# EAGLE design cable-concentrator (EAGLE 7.3.0)
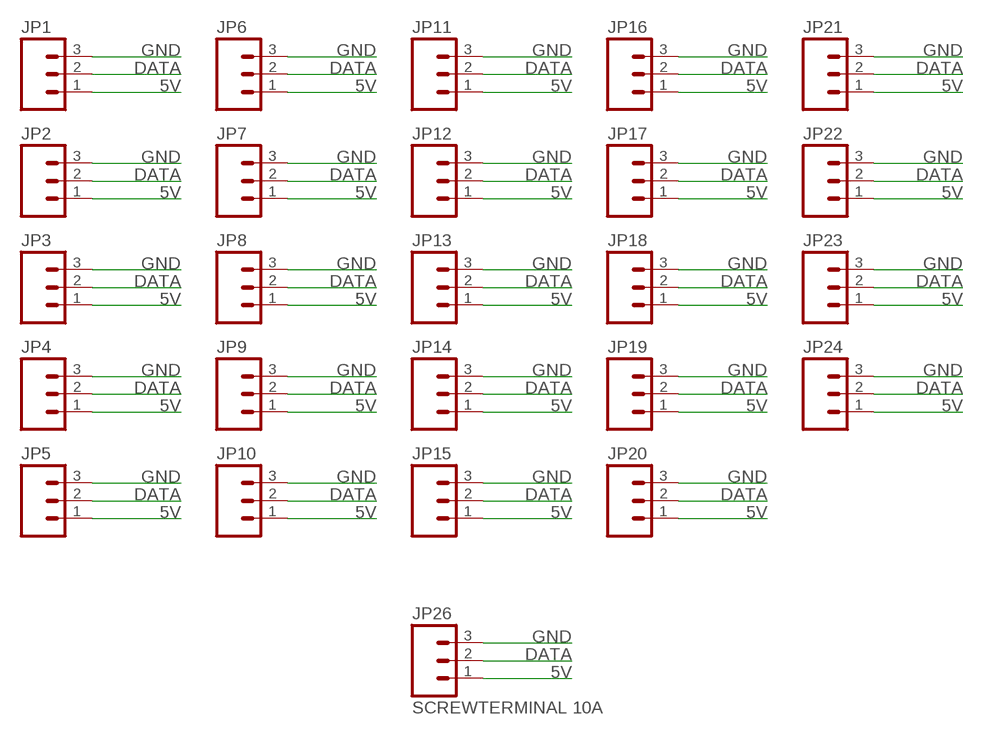
[diagram p0: schematic, sheet 1]

## Parts
JP1  M03PTH  [1X03]
JP2  M03PTH  [1X03]
JP3  M03PTH  [1X03]
JP4  M03PTH  [1X03]
JP5  M03PTH  [1X03]
JP6  M03PTH  [1X03]
JP7  M03PTH  [1X03]
JP8  M03PTH  [1X03]
JP9  M03PTH  [1X03]
JP10  M03PTH  [1X03]
JP11  M03PTH  [1X03]
JP12  M03PTH  [1X03]
JP13  M03PTH  [1X03]
JP14  M03PTH  [1X03]
JP15  M03PTH  [1X03]
JP16  M03PTH  [1X03]
JP17  M03PTH  [1X03]
JP18  M03PTH  [1X03]
JP19  M03PTH  [1X03]
JP20  M03PTH  [1X03]
JP21  M03PTH  [1X03]
JP22  M03PTH  [1X03]
JP23  M03PTH  [1X03]
JP24  M03PTH  [1X03]
JP26  SCREWTERMINAL 10A  M03SCREW  [SCREWTERMINAL-3.5MM-3]

## Nets
5V: JP1.1 JP2.1 JP3.1 JP4.1 JP5.1 JP6.1 JP7.1 JP8.1 JP9.1 JP10.1 JP11.1 JP12.1 JP13.1 JP14.1 JP15.1 JP16.1 JP17.1 JP18.1 JP19.1 JP20.1 JP21.1 JP22.1 JP23.1 JP24.1 JP26.1
DATA: JP1.2 JP2.2 JP3.2 JP4.2 JP5.2 JP6.2 JP7.2 JP8.2 JP9.2 JP10.2 JP11.2 JP12.2 JP13.2 JP14.2 JP15.2 JP16.2 JP17.2 JP18.2 JP19.2 JP20.2 JP21.2 JP22.2 JP23.2 JP24.2 JP26.2
GND: JP1.3 JP2.3 JP3.3 JP4.3 JP5.3 JP6.3 JP7.3 JP8.3 JP9.3 JP10.3 JP11.3 JP12.3 JP13.3 JP14.3 JP15.3 JP16.3 JP17.3 JP18.3 JP19.3 JP20.3 JP21.3 JP22.3 JP23.3 JP24.3 JP26.3

## Library data of the parts
JP1-JP24 JP26 = SparkFun-Connectors:M03: Header 3 Standard 3-pin 0.1" header. Use with straight break away headers (SKU : PRT-00116), right angle break away headers (PRT-00553), swiss pins (PRT-00743), machine pins (PRT-00117), and female headers (PRT-00115). Molex polarized connector foot print use with SKU : PRT-08232 with associated crimp pins and housings.

## Board
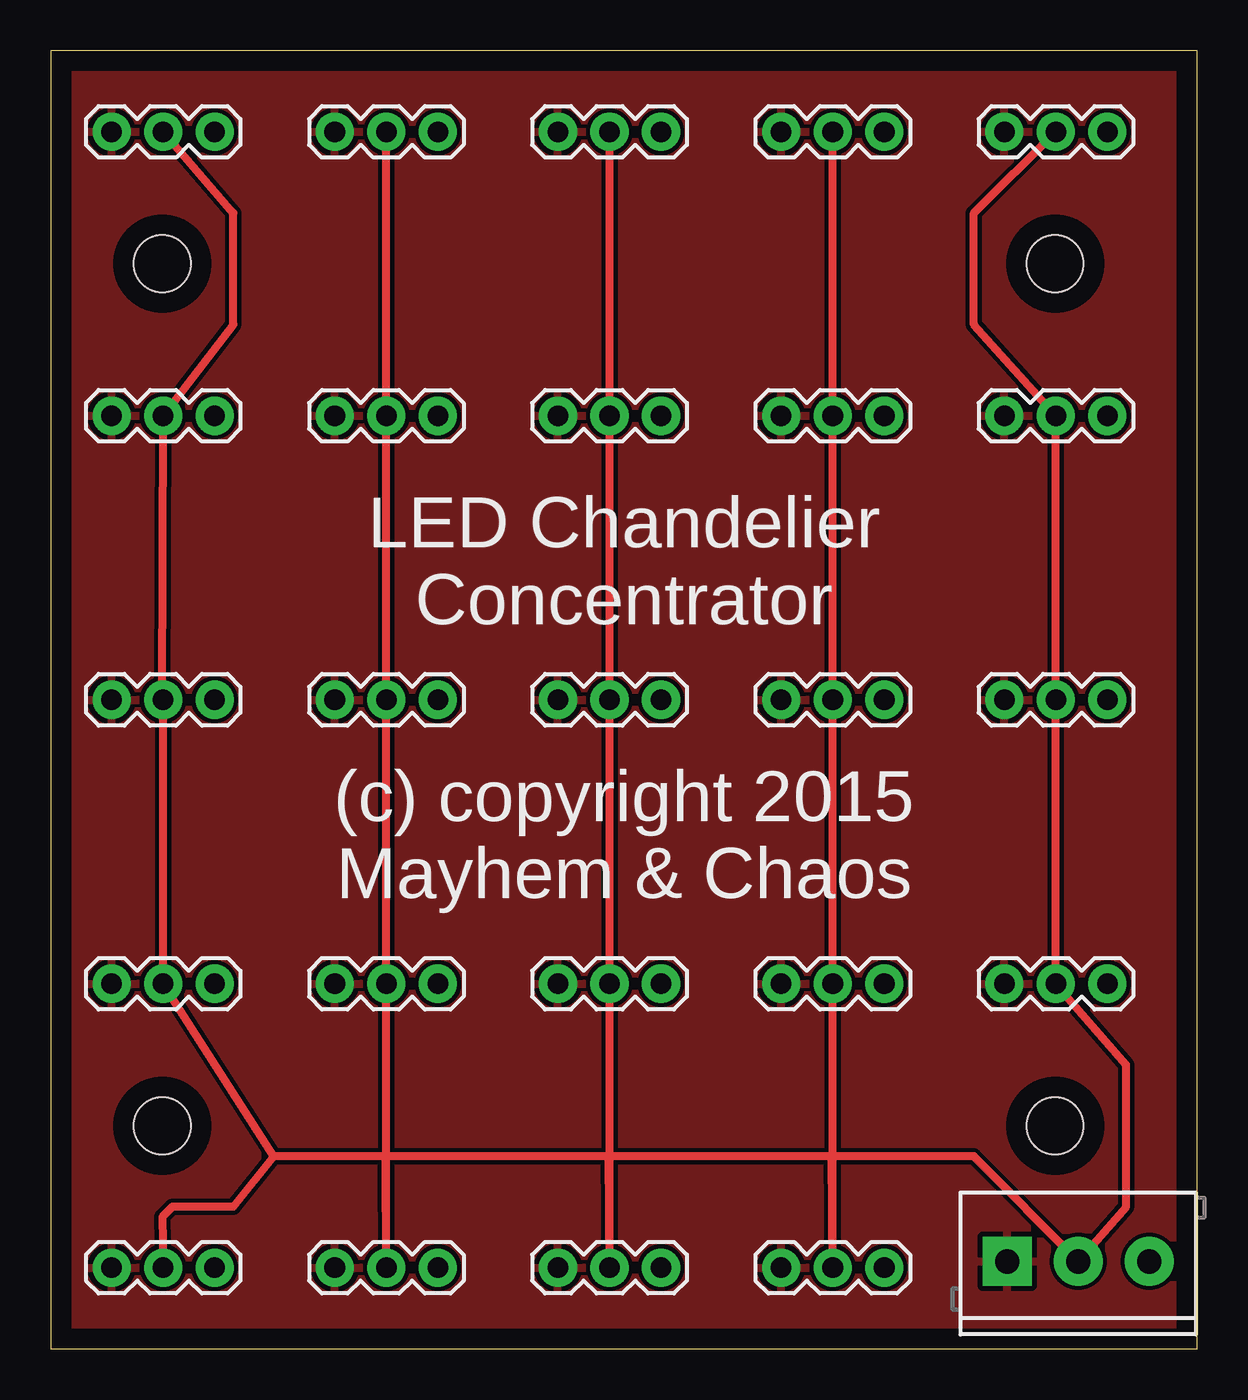
[diagram p1: board, top side]
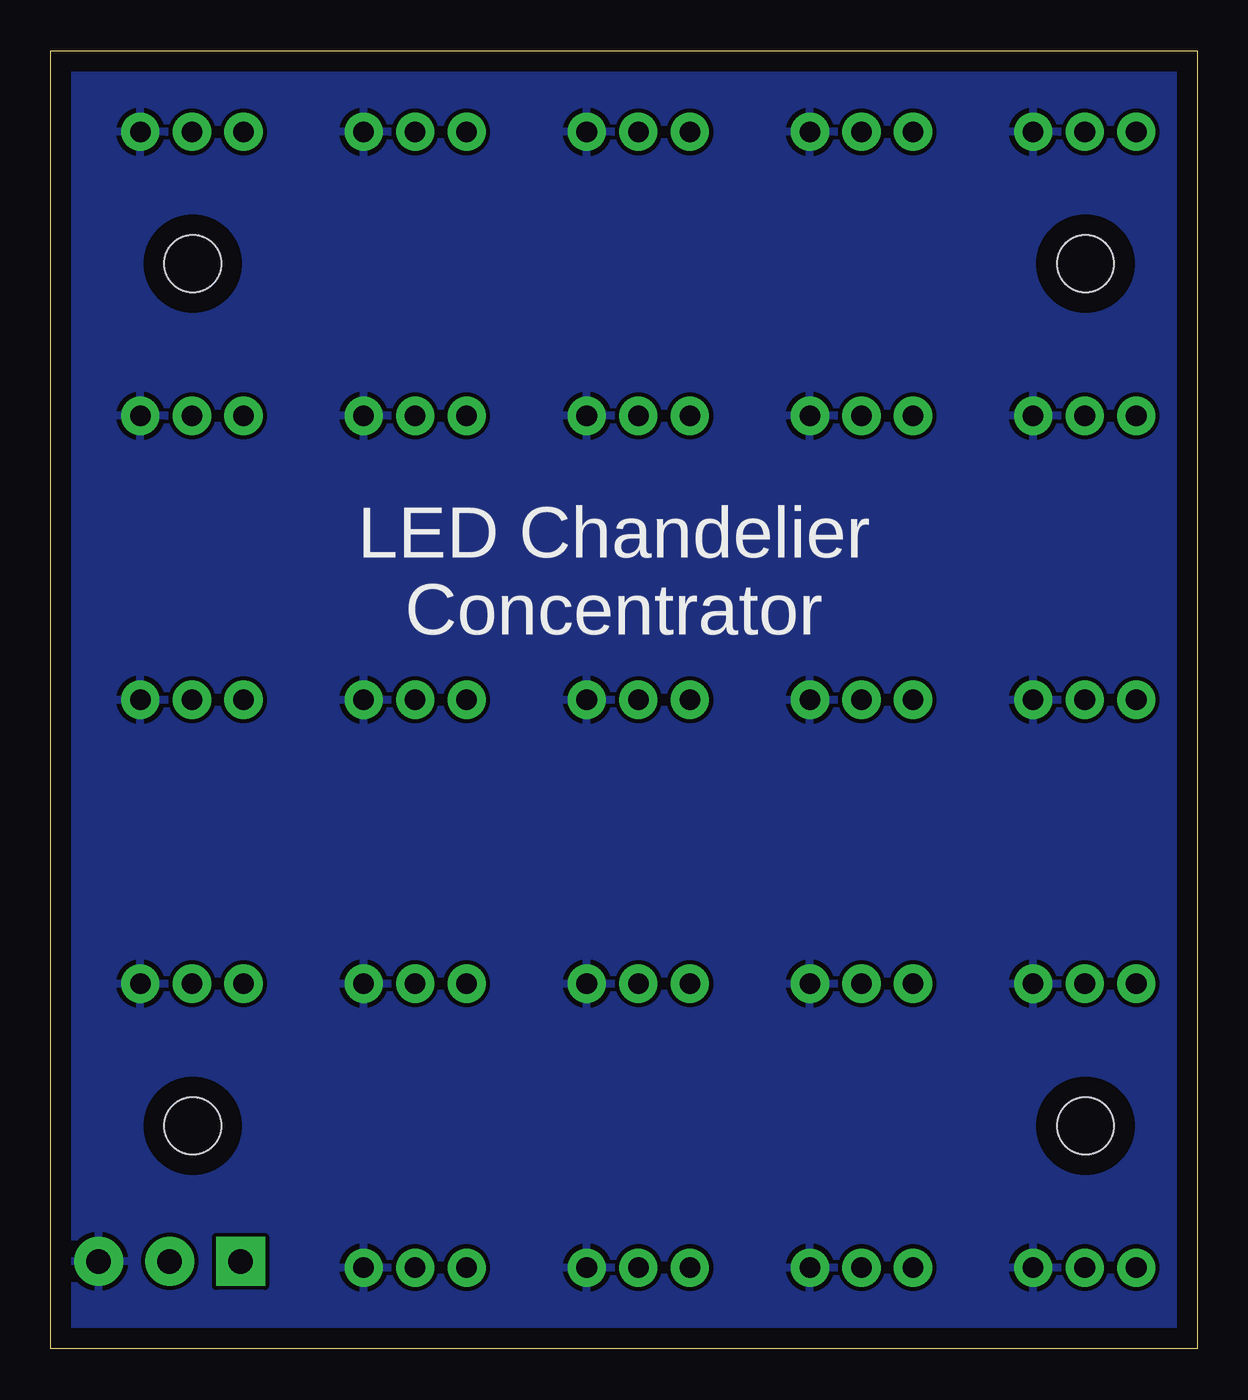
[diagram p2: board, bottom side, seen from below]

Size 56.5 x 64 mm. Coordinates in mm from the lower left corner, seen from the top.
Outline: 0,0 56.5,0 56.5,64 0,64 0,0
Copper layers (1*16): Top 0.035mm / dielectric 1.5mm / Bottom 0.035mm
Design rules "default": minimum track width 10mil, minimum drill 24mil, track to track 8mil, track to pad 8mil, pad to pad 8mil, via to via 8mil, smd to smd 8mil, copper to edge 40mil, drill to drill 8mil, minimum pad ring 10mil, minimum via ring 8mil, stop-mask expansion 4mil, vias tented up to drill 0mil, thermal gap 10mil
Holes 2.8 mm at 5.5,53.5 49.5,53.5 5.5,11 49.5,11

### Footprints (pad centres in the part's own frame; a part is rotated, then mirrored left to right if it is on the bottom)
1X03 = drill 1.016 pad 1.88: 1 0,0; 2 2.54,0; 3 5.08,0
SCREWTERMINAL-3.5MM-3 = drill 1.2 pad 2.413 square: 1 0,0 | drill 1.2 pad 2.413: 2 3.5,0; 3 7,0

### Placement (x,y rotation side)
JP1  14,32 0 top
JP2  14,60 0 top
JP3  14,4 0 top
JP4  14,18 0 top
JP5  14,46 0 top
JP6  3,4 0 top
JP7  25,60 0 top
JP8  36,4 0 top
JP9  25,4 0 top
JP10  3,18 0 top
JP11  47,18 0 top
JP12  36,18 0 top
JP13  25,18 0 top
JP14  3,32 0 top
JP15  47,32 0 top
JP16  36,32 0 top
JP17  25,32 0 top
JP18  3,46 0 top
JP19  47,46 0 top
JP20  36,46 0 top
JP21  25,46 0 top
JP22  3,60 0 top
JP23  47,60 0 top
JP24  36,60 0 top
JP26  47.14,4.31 0 top

### Tracks (layer width: path | path; a pad name or v marks a point on that pad's centre or on a via)
5V
  pour Top: 0,64 56.5,64 56.5,0 0,0
DATA
  Top 0.406: 38.54,9.5 JP8.2 38.5,9.5 27.54,9.5 | 38.54,9.5 JP12.2 JP16.2 JP20.2 JP24.2 | 27.54,9.5 JP9.2 27.5,9.5 16.54,9.5 | 27.54,9.5 JP13.2 JP17.2 JP21.2 JP7.2 | 16.54,9.5 JP3.2 16.5,9.5 11,9.5 | 16.54,9.5 JP4.2 JP1.2 JP5.2 JP2.2 | JP22.2 9,56 9,50.5 JP18.2 5.5,32 JP14.2 JP10.2 11,9.5 | JP23.2 45.5,56 45.5,50.5 JP19.2 JP15.2 JP11.2 53,14 53,7 JP26.2 45.5,9.5 38.54,9.5 | 11,9.5 9,7 6,7 5.5,6.5 JP6.2
GND
  pour Bottom: 0,64 56.5,64 56.5,-0.5 0,-0.5

### Text on the board
tNames: LED Chandelier / Concentrator | (c) copyright 2015 / Mayhem & Chaos
bNames: LED Chandelier / Concentrator
tValues: +5V | DATA | GND